# EasyEDA schematic LM317 Voltage supply_2020-10-09_18-57-09.json
TITLE: Sheet_1; REV: 1.0; Date: 2020-09-14; Sheet: 1/1; Drawn By: Manas Pange; Company: Your Company
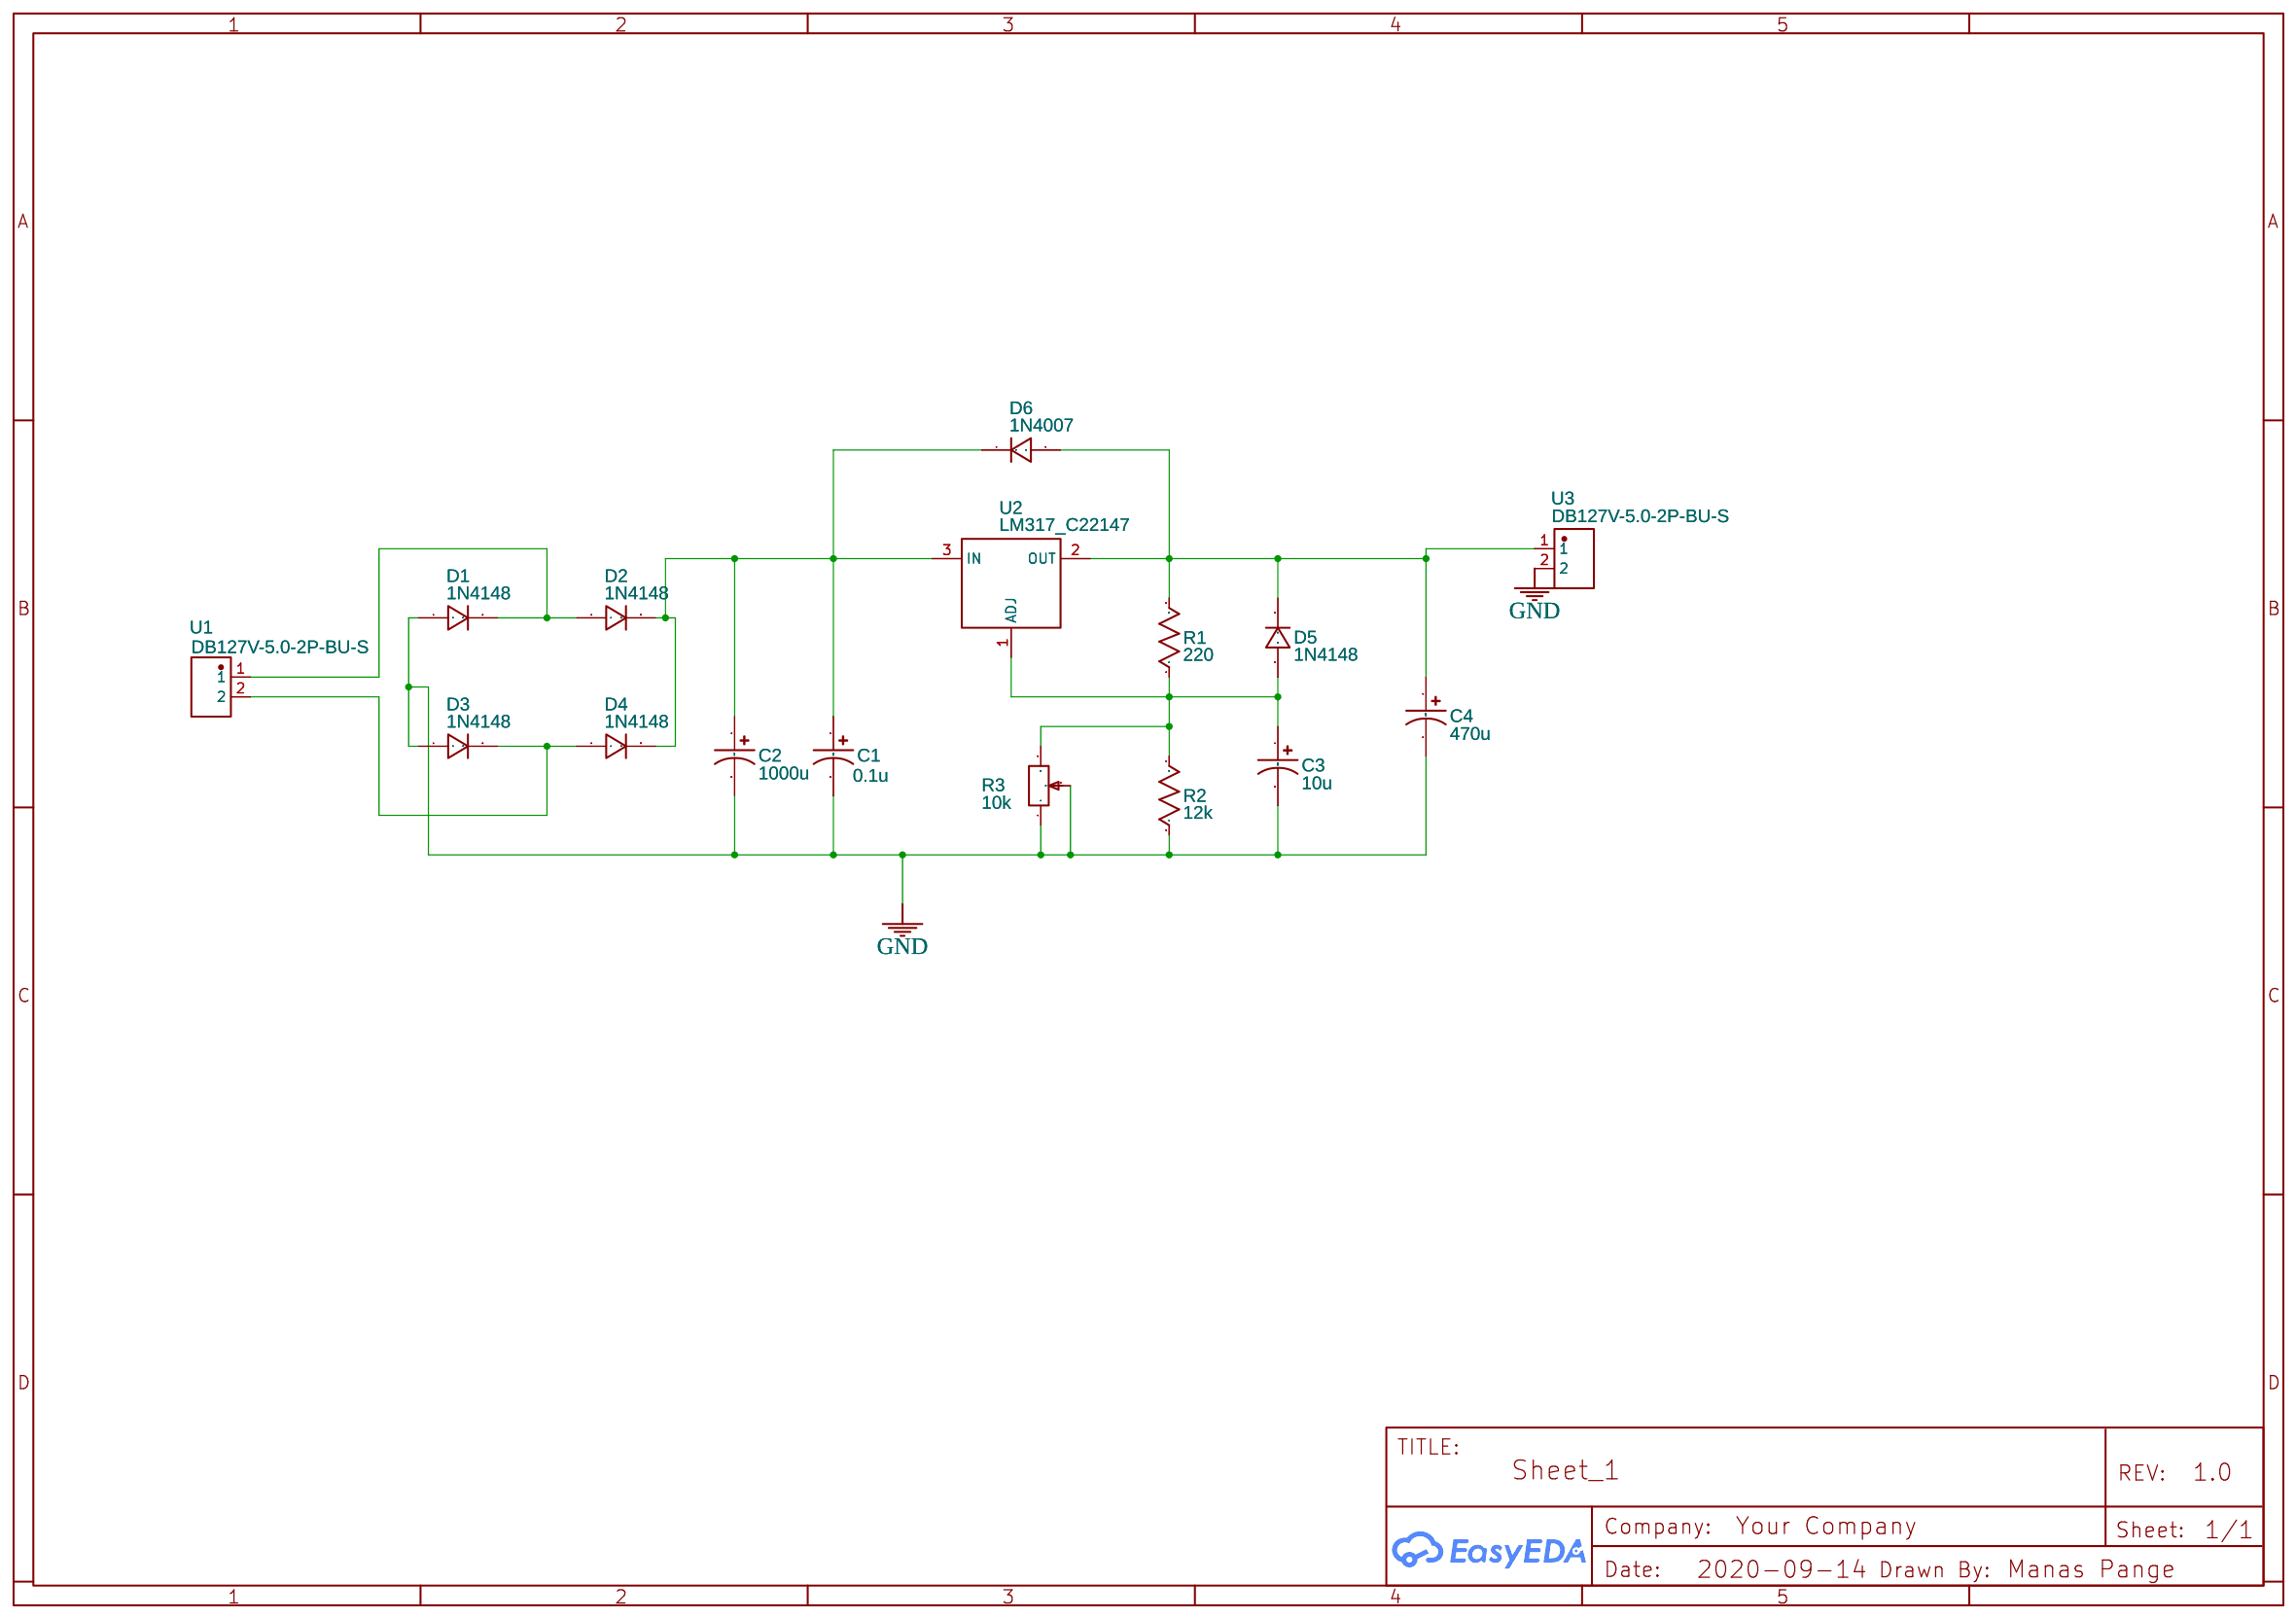
[diagram p0: schematic sheet]

## Parts
C1  0.1u  [CAP-D6.3×F2.5]
C2  1000u  [CAP-D6.3×F2.5]
C3  10u  [CAP-D6.3×F2.5]
C4  470u  [CAP-D6.3×F2.5]
D1  1N4148  [DO-35_BD2.0-L4.0-P8.00-D0.5-FD]
D2  1N4148  [DO-35_BD2.0-L4.0-P8.00-D0.5-FD]
D3  1N4148  [DO-35_BD2.0-L4.0-P8.00-D0.5-FD]
D4  1N4148  [DO-35_BD2.0-L4.0-P8.00-D0.5-FD]
D5  1N4148  [DO-35_BD2.0-L4.0-P8.00-D0.5-FD]
D6  1N4007  [DO-41_BD2.4-L4.7-P8.70-D0.9-RD]
R1  220  [R_AXIAL-0.3]
R2  12k  [R_AXIAL-0.3]
R3  10k  [RES-ADJ-TH_RK1631110TT3]
U1  DB127V-5.0-2P-BU-S  [CONN-TH_DB127V-5.0-2P-XX-S]
U2  LM317_C22147  [TO-220-3_L10.0-W4.5-P2.54-L]
U3  DB127V-5.0-2P-BU-S  [CONN-TH_DB127V-5.0-2P-XX-S]

## Library data of the parts
C1-C4 = CE_TH_D6.3×F2.5_US: Contributor: LCEDA_Lib
D1-D5 = 1N4148: Supplier: LCSC; Manufacturer: SEMTECH; Supplier Part: C14516; Contributor: LCEDA_Lib
D6 = 1N4007: Supplier: LCSC; Manufacturer: SEMTECH; Supplier Part: C106903; Contributor: LCEDA_Lib
R1 R2 = R_AXIAL-0.3_US: Contributor: LCEDA_Lib
R3 = RK1631110TT3: Supplier: LCSC; Supplier Part: C370977; Manufacturer: ALPS Electric; Contributor: LCSC
U1 U3 = DB127V-5.0-2P-BU-S: Supplier: LCSC; Supplier Part: C500019; Manufacturer: DIBO; Contributor: LCSC
U2 = LM317_C22147: Supplier: LCSC; Manufacturer: CJ; Manufacturer Part: LM317; Supplier Part: C22147; Contributor: 立创EDA官方封装库

## Nets
GND: C1.2 C2.2 C3.2 C4.2 D1.1 D3.1 R2.1 R3.1 R3.2 U3.2
Net-(C1-1): C1.1 C2.1 D2.2 D4.2 D6.1 U2.3(IN)
Net-(C3-1): C3.1 D5.1 R1.1 R2.2 R3.3 U2.1(ADJ)
Net-(C4-1): C4.1 D5.2 D6.2 R1.2 U2.2(OUT) U3.1
Net-(D1-2): D1.2 D2.1 U1.1
Net-(D3-2): D3.2 D4.1 U1.2
